# Altium schematic sheet 电子脚铐便携式主控板-Power.SchDoc
size A4
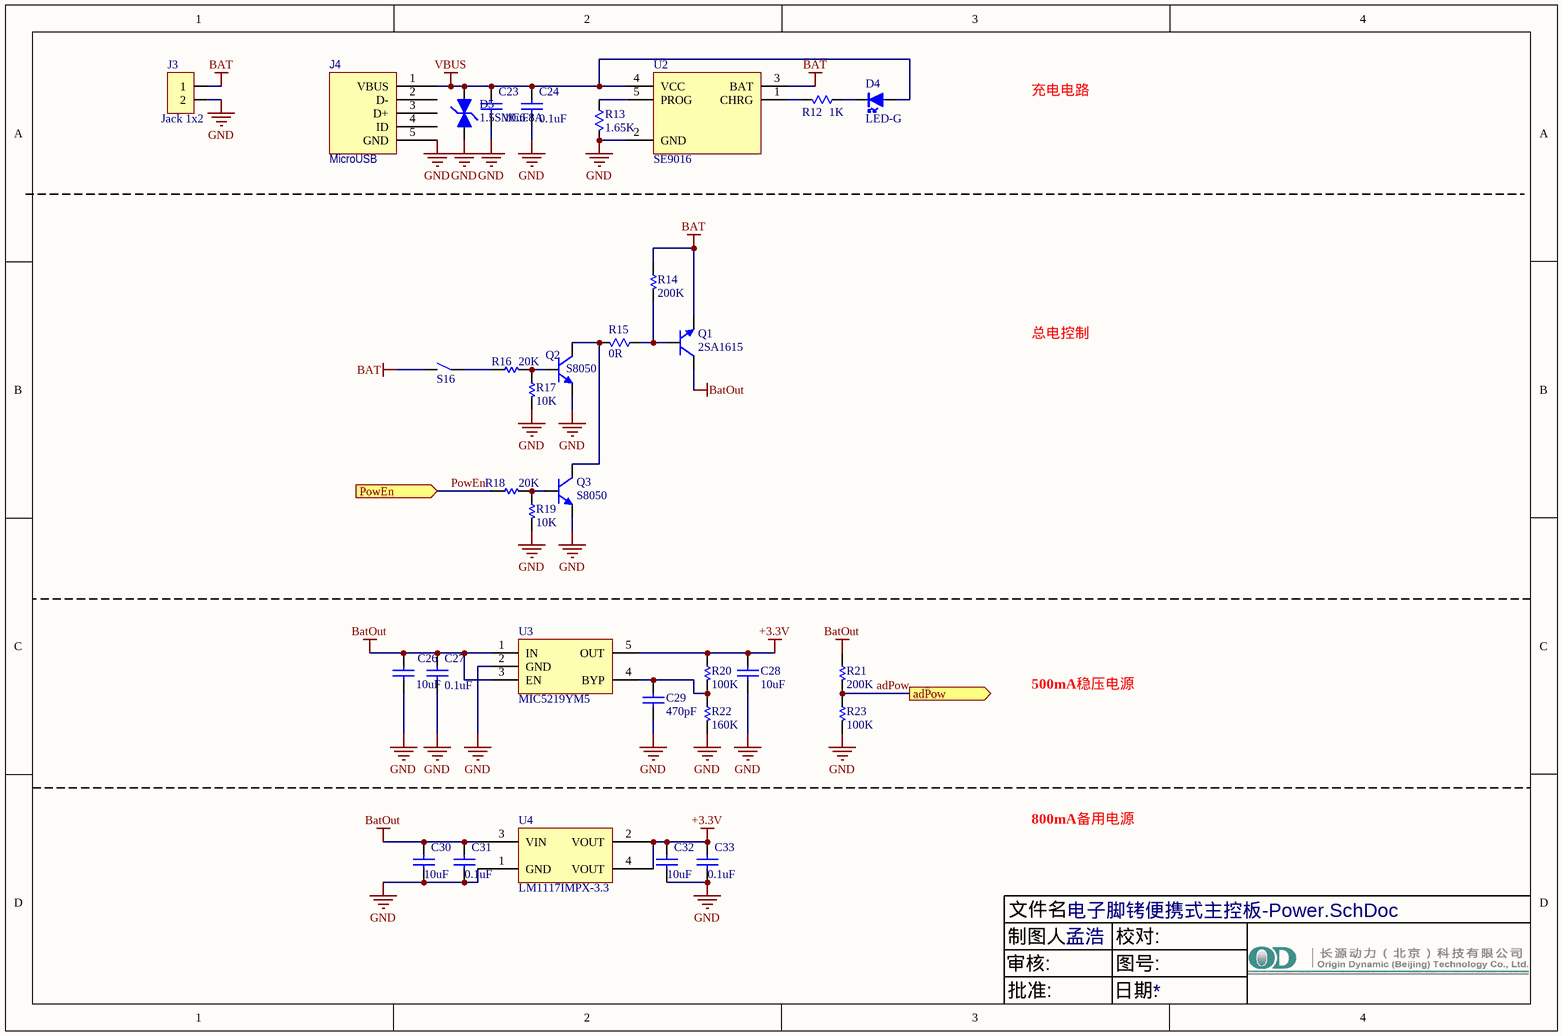
[diagram p0: 电子脚铐便携式主控板-Power.SchDoc]

## Parts
C23  10uF  [C1206]
C24  0.1uF  [C0603]
C26  10uF  [C0603]
C27  0.1uF  [C0603]
C28  10uF  [C0603]
C29  470pF  [C0603]
C30  10uF  [C0603]
C31  0.1uF  [C0603]
C32  10uF  [C0603]
C33  0.1uF  [C0603]
D4  LED-G  [LED0805]
D5  1.5SMC6.8A  [SMC]
J3  Jack 1x2  [DF13-2P-1.25V]
J4  MicroUSB  [MICRO-USB]
Q1  2SA1615  [TO-252]
Q2  S8050  [SOT-23]
Q3  S8050  [SOT-23]
R12  1K  [R0603]
R13  1.65K  [R0603]
R14  200K  [R0603]
R15  0R  [R0603]
R16  20K  [R0603]
R17  10K  [R0603]
R18  20K  [R0603]
R19  10K  [R0603]
R20  100K  [R0603]
R21  200K  [R0603]
R22  160K  [R0603]
R23  100K  [R0603]
S16  Switch  [SWITCH-H]  (value not drawn)
U2  SE9016  [SOT-23-5]
U3  MIC5219YM5  [SOT-23-5]
U4  LM1117IMPX-3.3  [SOT-223]

## Ports
adPow (out), PowEn (in)

## Nets
+3.3V: C28.1 C32.1 C33.1 R20.1 U3.5(OUT) U4.2(VOUT) U4.4(VOUT)
BAT: J3.1 Q1.3(E) R14.1 S16.2 U2.3(BAT)
BatOut: C26.1 C27.2 C30.1 C31.1 Q1.2(C) R21.1 U3.1(IN) U3.3(EN) U4.3(VIN)
GND: C23.2 C24.2 C26.2 C27.1 C28.2 C29.2 C30.2 C31.2 C32.2 C33.2 D5.2(K) J3.2 J4.5(GND) Q2.2(e) Q3.2(e) R13.1 R17.2 R19.2 R22.2 R23.2 U2.2(GND) U3.2(GND) U4.1(GND)
VBUS: C23.1 C24.1 D4.1(A) D5.1(A) J4.1(VBUS) U2.4(VCC)
adPow: R21.2 R23.1 ; port adPow
PowEn: R18.1 ; port PowEn
NetC29_1: C29.1 R20.2 R22.1 U3.4(BYP)
NetD4_2: D4.2(K) R12.2
NetQ1_1: Q1.1(B) R14.2 R15.1
NetQ2_1: Q2.1(b) R16.2 R17.1
NetQ2_3: Q2.3(c) Q3.3(c) R15.2
NetQ3_1: Q3.1(b) R18.2 R19.1
NetR12_1: R12.1 U2.1(CHRG)
NetR13_2: R13.2 U2.5(PROG)
NetR16_1: R16.1 S16.1

Not connected (* = marked no-connect by the designer): J4 2(D-) 3(D+) 4(ID)

## Notes on the sheet
- 充电电路
- 总电控制
- 500mA稳压电源
- 800mA备用电源
- 文件名:
- 审核:
- 制图人:
- 孟浩
- 校对:
- 图号:
- 批准:
- 日期:

## Library data of the parts
C23 C24 = Cap: Capacitor
  C23: Published: 8-Jun-2000; LatestRevisionDate: 17-Jul-2002; LatestRevisionNote: Re-released for DXP Platform.; PackageReference: RAD-0.3; Publisher: Altium Limited; PackageDescription: Radial Cap, Thru-Hole; 2 Leads; 0.3 in Pin Spacing; Value: 10uF
C26 C28-C33 = CAP
  C26 C28: Published: 8-Jun-2000; LatestRevisionDate: 17-Jul-2002; LatestRevisionNote: Re-released for DXP Platform.; PackageReference: RAD-0.3; Publisher: Altium Limited; Value: 10uF
  C29: Published: 8-Jun-2000; LatestRevisionDate: 17-Jul-2002; LatestRevisionNote: Re-released for DXP Platform.; PackageReference: RAD-0.3; Publisher: Altium Limited; Value: 470pF
C27 = Cap Semi
D4 = LED
D5 = Diode-TVS
J3 = Jack 1x2: 插座
Q1 = MJD122
Q2 Q3 = S8050: NPN triode, 0.5A Max
R12 R13 = Res: Resistor; Published: 8-Jun-2000; LatestRevisionDate: 04-Mar-2005; LatestRevisionNote: PCB Footprint replaced.; PackageReference: J1-0603; Publisher: Altium Limited
  R12: Value: 1K
  R13: Value: 1.65K
R14 R16-R23 = Res
R15 = RES: Resistor; Published: 8-Jun-2000; LatestRevisionDate: 17-Jul-2002; LatestRevisionNote: Re-released for DXP Platform.; PackageReference: AXIAL-0.3; Publisher: Altium Limited; Value: 0R
S16 = Sw
U3 = MIC5205
U4 = AMS1117: 800mA Low-Dropout Linear Regulator